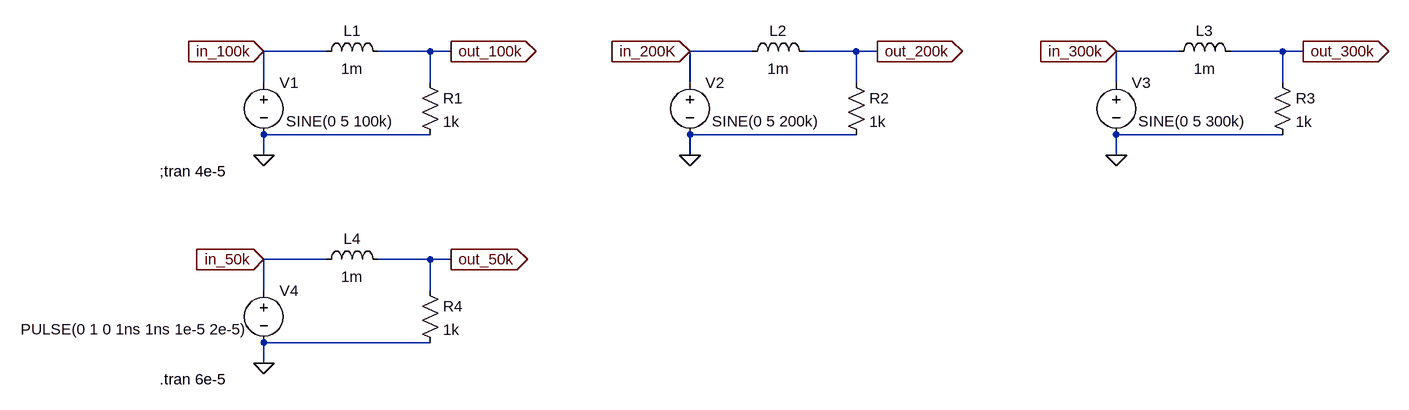
[diagram p0: schematic RL_curcuit.asc]
RL_curcuit.asc, the LTspice schematic file:
Version 4
SHEET 1 1008 680
WIRE -672 112 -768 112
WIRE -512 112 -592 112
WIRE -480 112 -512 112
WIRE -16 112 -112 112
WIRE 144 112 64 112
WIRE 176 112 144 112
WIRE 640 112 544 112
WIRE 800 112 720 112
WIRE 832 112 800 112
WIRE -768 160 -768 112
WIRE -512 160 -512 112
WIRE -112 160 -112 112
WIRE 144 160 144 112
WIRE 544 160 544 112
WIRE 800 160 800 112
WIRE -512 240 -768 240
WIRE 144 240 -112 240
WIRE 800 240 544 240
WIRE -768 272 -768 240
WIRE -112 272 -112 240
WIRE 544 272 544 240
WIRE -672 432 -768 432
WIRE -512 432 -592 432
WIRE -480 432 -512 432
WIRE -768 480 -768 432
WIRE -512 480 -512 432
WIRE -512 560 -768 560
WIRE -768 592 -768 560
FLAG -768 272 0
FLAG -768 112 in_100k
IOPIN -768 112 In
FLAG -480 112 out_100k
IOPIN -480 112 Out
FLAG -112 272 0
FLAG -112 112 in_200K
IOPIN -112 112 In
FLAG 176 112 out_200k
IOPIN 176 112 Out
FLAG 544 272 0
FLAG 544 112 in_300k
IOPIN 544 112 In
FLAG 832 112 out_300k
IOPIN 832 112 Out
FLAG -768 592 0
FLAG -768 432 in_50k
IOPIN -768 432 In
FLAG -480 432 out_50k
IOPIN -480 432 Out
SYMBOL voltage -768 144 R0
WINDOW 3 34 75 Left 2
WINDOW 123 0 0 Left 2
WINDOW 39 0 0 Left 2
SYMATTR Value SINE(0 5 100k)
SYMATTR InstName V1
SYMBOL ind -688 128 R270
WINDOW 0 32 56 VTop 2
WINDOW 3 5 56 VBottom 2
SYMATTR InstName L1
SYMATTR Value 1m
SYMBOL res -528 144 R0
SYMATTR InstName R1
SYMATTR Value 1k
SYMBOL voltage -112 144 R0
WINDOW 3 34 75 Left 2
WINDOW 123 0 0 Left 2
WINDOW 39 0 0 Left 2
SYMATTR Value SINE(0 5 200k)
SYMATTR InstName V2
SYMBOL ind -32 128 R270
WINDOW 0 32 56 VTop 2
WINDOW 3 5 56 VBottom 2
SYMATTR InstName L2
SYMATTR Value 1m
SYMBOL res 128 144 R0
SYMATTR InstName R2
SYMATTR Value 1k
SYMBOL voltage 544 144 R0
WINDOW 3 34 75 Left 2
WINDOW 123 0 0 Left 2
WINDOW 39 0 0 Left 2
SYMATTR Value SINE(0 5 300k)
SYMATTR InstName V3
SYMBOL ind 624 128 R270
WINDOW 0 32 56 VTop 2
WINDOW 3 5 56 VBottom 2
SYMATTR InstName L3
SYMATTR Value 1m
SYMBOL res 784 144 R0
SYMATTR InstName R3
SYMATTR Value 1k
SYMBOL voltage -768 464 R0
WINDOW 3 -374 75 Left 2
WINDOW 123 0 0 Left 2
WINDOW 39 0 0 Left 2
SYMATTR Value PULSE(0 1 0 1ns 1ns 1e-5 2e-5)
SYMATTR InstName V4
SYMBOL ind -688 448 R270
WINDOW 0 32 56 VTop 2
WINDOW 3 5 56 VBottom 2
SYMATTR InstName L4
SYMATTR Value 1m
SYMBOL res -528 464 R0
SYMATTR InstName R4
SYMATTR Value 1k
TEXT -928 296 Left 2 !;tran 4e-5
TEXT -928 616 Left 2 !.tran 6e-5

The netlist it stands for:
* RL_curcuit.asc
V1 in_100k 0 SINE(0 5 100k)
L1 in_100k out_100k 1m
R1 out_100k 0 1k
V2 in_200K 0 SINE(0 5 200k)
L2 in_200K out_200k 1m
R2 out_200k 0 1k
V3 in_300k 0 SINE(0 5 300k)
L3 in_300k out_300k 1m
R3 out_300k 0 1k
V4 in_50k 0 PULSE(0 1 0 1ns 1ns 1e-5 2e-5)
L4 in_50k out_50k 1m
R4 out_50k 0 1k
;tran 4e-5
.tran 6e-5
.backanno
.end

* Results of the author's LTspice run, read from the files saved beside the schematic
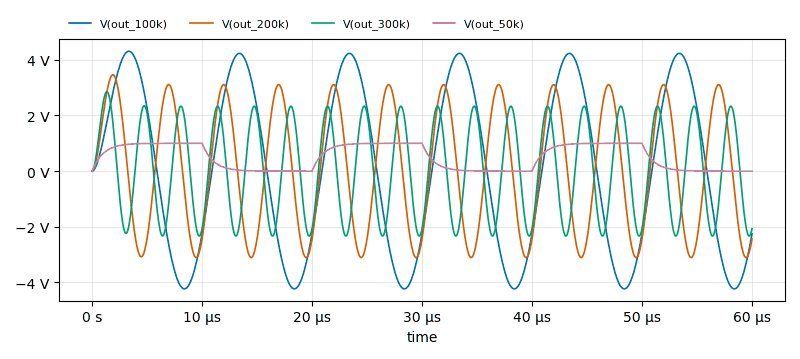
[diagram p1: Transient Analysis of RL_curcuit.asc, plotted from the saved traces]
* Transient Analysis, 1 run:
*   V(out_100k): min -4.232 V, max 4.309 V, average 37.56 mV, rms 3 V, last -2.252 V
*   V(out_200k): min -3.108 V, max 3.462 V, average 40.58 mV, rms 2.209 V, last -2.436 V
*   V(out_300k): min -2.334 V, max 2.854 V, average 34.44 mV, rms 1.661 V, last -2.069 V
*   V(out_50k): min 0 V, max 1 V, average 500 mV, rms 670.9 mV, last 45.34 µV